# Altium schematic sheet Logic.SchDoc: 16-bit Register
size A4; Address1: Smoka Wawelskiego 1; Address2: 30-535 Kraków, Poland; DocumentNumber: 4; Revision: v01; SheetNumber: 4; SheetTotal: 9; Author: Miroslaw Folejewski; CompanyName: Mirko Electronics; DrawnBy: Miroslaw Folejewski; Engineer: Miroslaw Folejewski; PageSetup: Record=PageOptions|CenterHorizontal=True|CenterVertical=True|PrintScale=1.00|XCorrection=1.00|YCorrection=1.00|PrintKind=0|BorderSize=5000000|LeftOffset=0|BottomOffset=0|Orientation=2|PaperLength=1000|PaperWidth=1000|Scale=100|PaperSource=7|PrintQuality=-4|MediaType=1|DitherType=10|PaperKind=A4|PrintScaleMode=1; PageSize: A4; Designators: -; ProjectName: 7-Segment LED Matrix Display
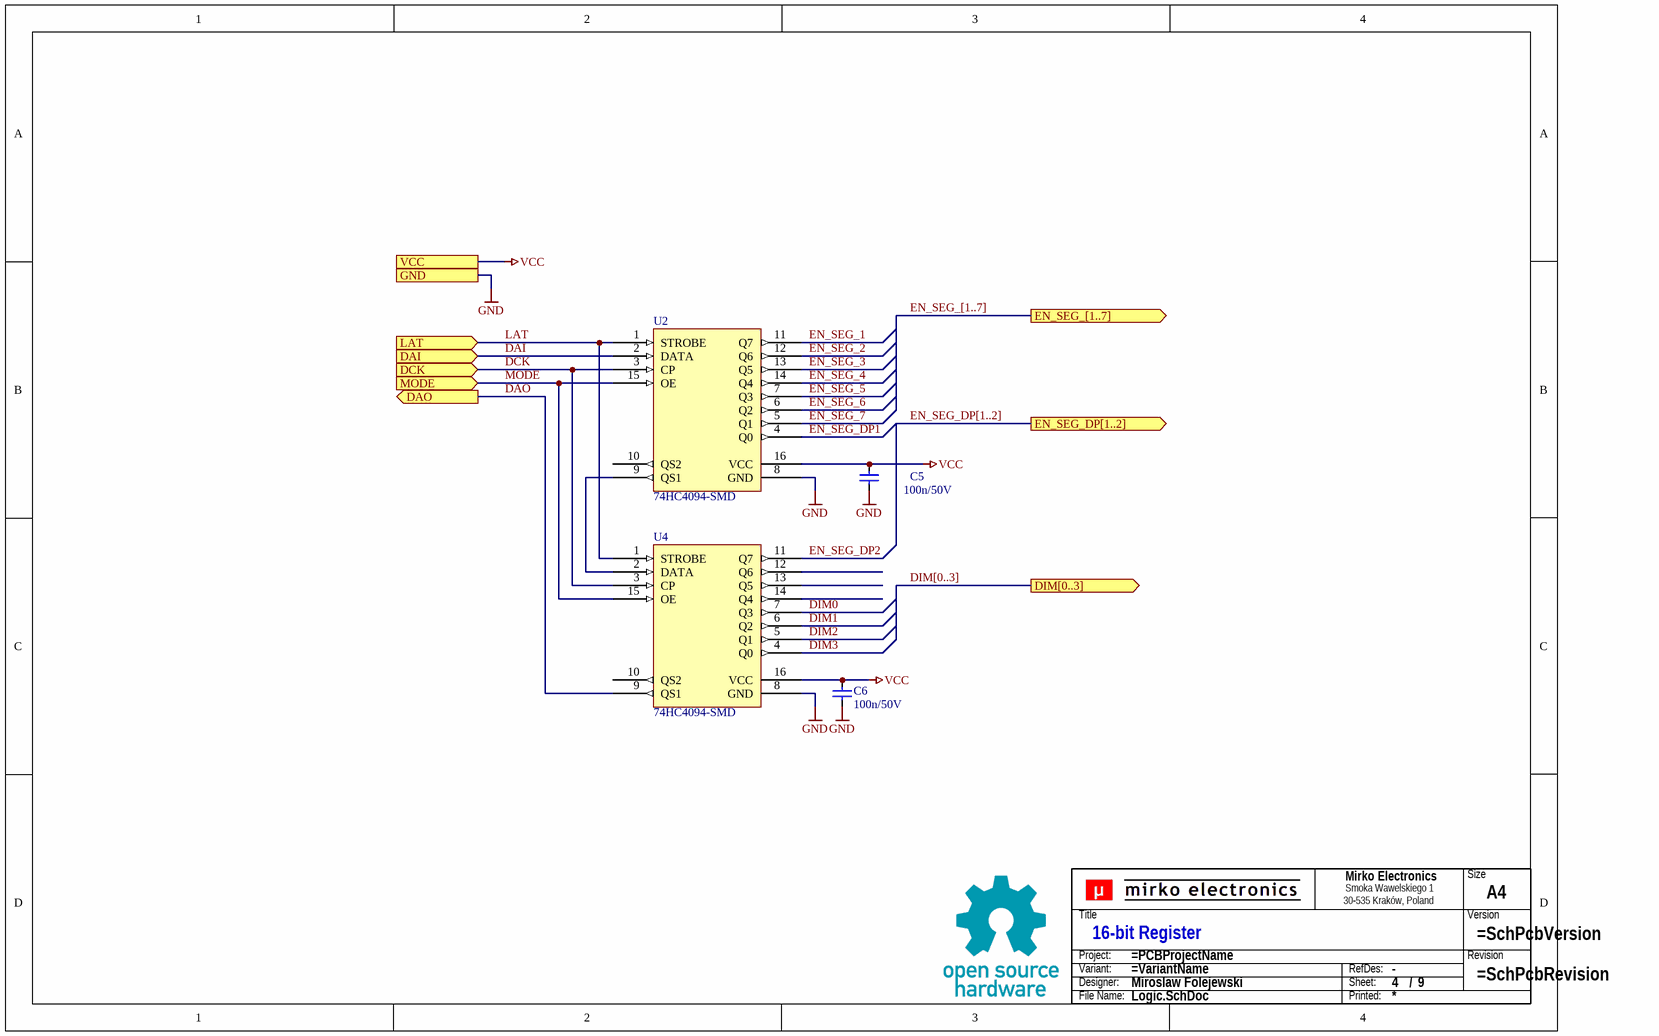
[diagram p0: Logic.SchDoc]

## Parts
?  (no value)  (graphical)
C5  100n/50V  [0805]
C6  100n/50V  [0805]
TB?  Title block  (value not drawn)  (graphical)
U2  74HC4094-SMD  [SO16N]
U4  74HC4094-SMD  [SO16N]

## Ports
DAI (in), DAO (out), DCK (in), DIM[0..3] (out), EN_SEG_[1..7] (out), EN_SEG_DP[1..2] (out), GND, LAT (in), MODE (in), VCC

## Nets
GND: C5.2 C6.2 U2.8(GND) U4.8(GND) ; port GND
VCC: C5.1 C6.1 U2.16(VCC) U4.16(VCC) ; port VCC
DAI: U2.2(DATA) ; port DAI
DAO: U4.9(QS1) ; port DAO
DCK: U2.3(CP) U4.3(CP) ; port DCK
DIM0: U4.7(Q3)
DIM1: U4.6(Q2)
DIM2: U4.5(Q1)
DIM3: U4.4(Q0)
EN_SEG_1: U2.11(Q7)
EN_SEG_2: U2.12(Q6)
EN_SEG_3: U2.13(Q5)
EN_SEG_4: U2.14(Q4)
EN_SEG_5: U2.7(Q3)
EN_SEG_6: U2.6(Q2)
EN_SEG_7: U2.5(Q1)
EN_SEG_DP1: U2.4(Q0)
EN_SEG_DP2: U4.11(Q7)
LAT: U2.1(STROBE) U4.1(STROBE) ; port LAT
MODE: U2.15(OE) U4.15(OE) ; port MODE
NetU2_9: U2.9(QS1) U4.2(DATA)

Not connected (* = marked no-connect by the designer): U2 10(QS2); U4 10(QS2) 12(Q6) 13(Q5) 14(Q4)

## Buses and harness runs
bus DIM[0..3] = port DIM[0..3]
bus EN_SEG_[1..7] = port EN_SEG_[1..7]
bus EN_SEG_DP[1..2] = port EN_SEG_DP[1..2]

## Notes on the sheet
- Title
- Size
- Revision
- Checked By:
- Project:
- Variant:
- Engineer:
- Date:
- Sheet:
- /
- Designators
- Approved By:
- File:
- (in symbol SCH_TITLE_BLOCK_V1) Size; Title; Version; Project:; Revision; Variant:; RefDes:; Designer:; Sheet:; /; File Name:; Printed:

## Library data of the parts
? = Title Block NeoStrain
C5 C6 = CAP
TB? = SCH_TITLE_BLOCK_V1: Component Type: Title block; Manufacturer: -; Mounting Type: Non component; MPN: -; Operating Temperature: -; Package: -; Specification: Title block; Value: Title block; Replacement: -; System: ?
U2 U4 = 74HC4094